# Altium schematic sheet SK-keys.SchDoc
size A; SheetNumber: 4; SheetTotal: 4
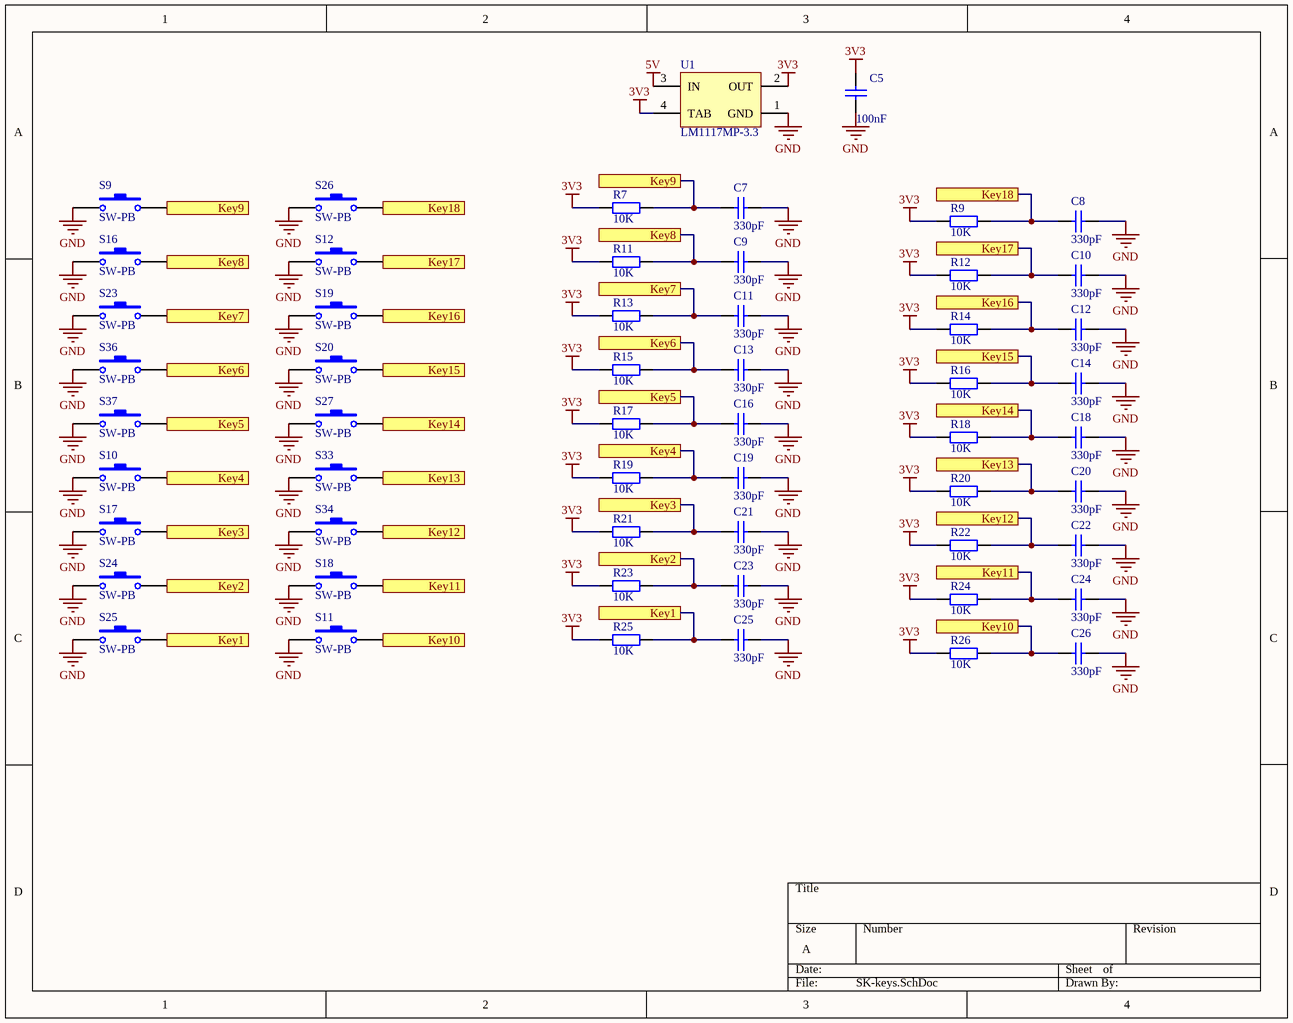
[diagram p0: SK-keys.SchDoc]

## Parts
C5  100nF  [SMH_1608[0603]_STD]
C7  330pF  [SMH_RES0805-STD]
C8  330pF  [SMH_RES0805-STD]
C9  330pF  [SMH_RES0805-STD]
C10  330pF  [SMH_RES0805-STD]
C11  330pF  [SMH_RES0805-STD]
C12  330pF  [SMH_RES0805-STD]
C13  330pF  [SMH_RES0805-STD]
C14  330pF  [SMH_RES0805-STD]
C16  330pF  [SMH_RES0805-STD]
C18  330pF  [SMH_RES0805-STD]
C19  330pF  [SMH_RES0805-STD]
C20  330pF  [SMH_RES0805-STD]
C21  330pF  [SMH_RES0805-STD]
C22  330pF  [SMH_RES0805-STD]
C23  330pF  [SMH_RES0805-STD]
C24  330pF  [SMH_RES0805-STD]
C25  330pF  [SMH_RES0805-STD]
C26  330pF  [SMH_RES0805-STD]
R7  10K  [SMH_RES0805-STD]
R9  10K  [SMH_RES0805-STD]
R11  10K  [SMH_RES0805-STD]
R12  10K  [SMH_RES0805-STD]
R13  10K  [SMH_RES0805-STD]
R14  10K  [SMH_RES0805-STD]
R15  10K  [SMH_RES0805-STD]
R16  10K  [SMH_RES0805-STD]
R17  10K  [SMH_RES0805-STD]
R18  10K  [SMH_RES0805-STD]
R19  10K  [SMH_RES0805-STD]
R20  10K  [SMH_RES0805-STD]
R21  10K  [SMH_RES0805-STD]
R22  10K  [SMH_RES0805-STD]
R23  10K  [SMH_RES0805-STD]
R24  10K  [SMH_RES0805-STD]
R25  10K  [SMH_RES0805-STD]
R26  10K  [SMH_RES0805-STD]
S9  SW-PB  [SMH_MX_Series_18mm]
S10  SW-PB  [SMH_MX_Series_18mm]
S11  SW-PB  [SMH_MX_Series_18mm]
S12  SW-PB  [SMH_MX_Series_18mm]
S16  SW-PB  [SMH_MX_Series_18mm]
S17  SW-PB  [SMH_MX_Series_18mm]
S18  SW-PB  [SMH_MX_Series_18mm]
S19  SW-PB  [SMH_MX_Series_18mm]
S20  SW-PB  [SMH_MX_Series_18mm]
S23  SW-PB  [SMH_MX_Series_18mm]
S24  SW-PB  [SMH_MX_Series_18mm]
S25  SW-PB  [SMH_MX_Series_18mm]
S26  SW-PB  [SMH_MX_Series_18mm]
S27  SW-PB  [SMH_MX_Series_18mm]
S33  SW-PB  [SMH_MX_SERIES-37MM]
S34  SW-PB  [SMH_MX_Series_18mm]
S36  SW-PB  [SMH_MX_Series-37mm]
S37  SW-PB  [SMH_MX_Series-42mm]
U1  LM1117MP-3.3  [SMH_SOT223]

## Ports
Key1, Key2, Key3, Key4, Key5, Key6, Key7, Key8, Key9, Key10, Key11, Key12, Key13, Key14, Key15, Key16, Key17, Key18

## Nets
3V3: C5.2 R7.1 R9.1 R11.1 R12.1 R13.1 R14.1 R15.1 R16.1 R17.1 R18.1 R19.1 R20.1 R21.1 R22.1 R23.1 R24.1 R25.1 R26.1 U1.2(OUT) U1.4(TAB)
5V: U1.3(IN)
GND: C5.1 C7.2 C8.2 C9.2 C10.2 C11.2 C12.2 C13.2 C14.2 C16.2 C18.2 C19.2 C20.2 C21.2 C22.2 C23.2 C24.2 C25.2 C26.2 S9.1 S10.1 S11.1 S12.1 S16.1 S17.1 S18.1 S19.1 S20.1 S23.1 S24.1 S25.1 S26.1 S27.1 S33.1 S34.1 S36.2 S37.2 U1.1(GND)
Key1: C25.1 R25.2 S25.2 ; port Key1
Key2: C23.1 R23.2 S24.2 ; port Key2
Key3: C21.1 R21.2 S17.2 ; port Key3
Key4: C19.1 R19.2 S10.2 ; port Key4
Key5: C16.1 R17.2 S37.1 ; port Key5
Key6: C13.1 R15.2 S36.1 ; port Key6
Key7: C11.1 R13.2 S23.2 ; port Key7
Key8: C9.1 R11.2 S16.2 ; port Key8
Key9: C7.1 R7.2 S9.2 ; port Key9
Key10: C26.1 R26.2 S11.2 ; port Key10
Key11: C24.1 R24.2 S18.2 ; port Key11
Key12: C22.1 R22.2 S34.2 ; port Key12
Key13: C20.1 R20.2 S33.2 ; port Key13
Key14: C18.1 R18.2 S27.2 ; port Key14
Key15: C14.1 R16.2 S20.2 ; port Key15
Key16: C12.1 R14.2 S19.2 ; port Key16
Key17: C10.1 R12.2 S12.2 ; port Key17
Key18: C8.1 R9.2 S26.2 ; port Key18

## Library data of the parts
C5 = Cap Semi: Capacitor (Semiconductor SIM Model); Published: 8-Jun-2000; LatestRevisionDate: 29-May-2009; LatestRevisionNote: IPC-7351 Footprint Added.; PackageReference: C1206; Publisher: Altium Limited; PackageDescription: Chip Capacitor; Value: 100nF
C7-C14 C16 C18-C26 = Cap: Capacitor; Published: 8-Jun-2000; LatestRevisionDate: 17-Jul-2002; LatestRevisionNote: Re-released for DXP Platform.; PackageReference: RAD-0.3; Publisher: Altium Limited; Value: 330pF
R7 R9 R11-R26 = Res2: Resistor; Published: 8-Jun-2000; LatestRevisionDate: 17-Jul-2002; LatestRevisionNote: Re-released for DXP Platform.; PackageReference: AXIAL-0.4; Publisher: Altium Limited; PackageDescription: Axial Device, Thru-Hole; 2 Leads; 0.4 in Pin Spacing; Value: 10K
S9-S12 S16-S20 S23-S27 S33 S34 S36 S37 = SW-PB: Switch; Published: 24-Mar-1999; LatestRevisionDate: 17-Jul-2002; LatestRevisionNote: Re-released for DXP Platform.; PackageReference: SPST-2; Publisher: Altium Limited; PackageDescription: Switch; 2 Leads
U1 = LM1117MP-3.3: 800mA Low-Dropout Linear Regulator, 4-pin SOT-223; Manufacturer: National Semiconductor; PackageTopMarking: XYTT*N05A; PowerWise: N; CompType: LDO IC; Published: 4-Dec-2008; DatasheetVersion: Apr-2006; PackageVersion: revB, Apr-2003; PackageReference: MP04A; Publisher: Altium Limited; PackageDescription: Molded SOT-223, 6.50 x 3.56 x 1.6mm Body, 4 Lead, 2.3mm Pitch; Supplier 1: Farnell; Supplier Part Number 1: 9778195; Supplier 2: Farnell; Supplier Part Number 2: 9778195RL; PartNumber: LM1117MP-3.3; RoHS: N; PinCount: 4; Code_JEDEC: TO-261-AA; Code_IPC: SOT223-4; ComponentLink1Description: LM1117 Datasheet; ComponentLink1URL: http://www.national.com/ds/LM/LM1117.pdf; ComponentLink2Description: LM1117 Web Page; ComponentLink2URL: http://www.national.com/pf/LM/LM1117.html; ComponentLink3Description: MP04A Package Page; ComponentLink3URL: http://www.national.com/packaging/folders/mp04a.html